# EasyEDA Pro project coba1.eprj

# Schematic Schematic1
Board Name: Board1; Create Date: 2026-02-27; Page Name: P1; Project Name: coba1; Schematic Name: Schematic1; Update Date: 2026-02-28; Company: EasyEDA.com; Page Size: A4; Version: V1.0
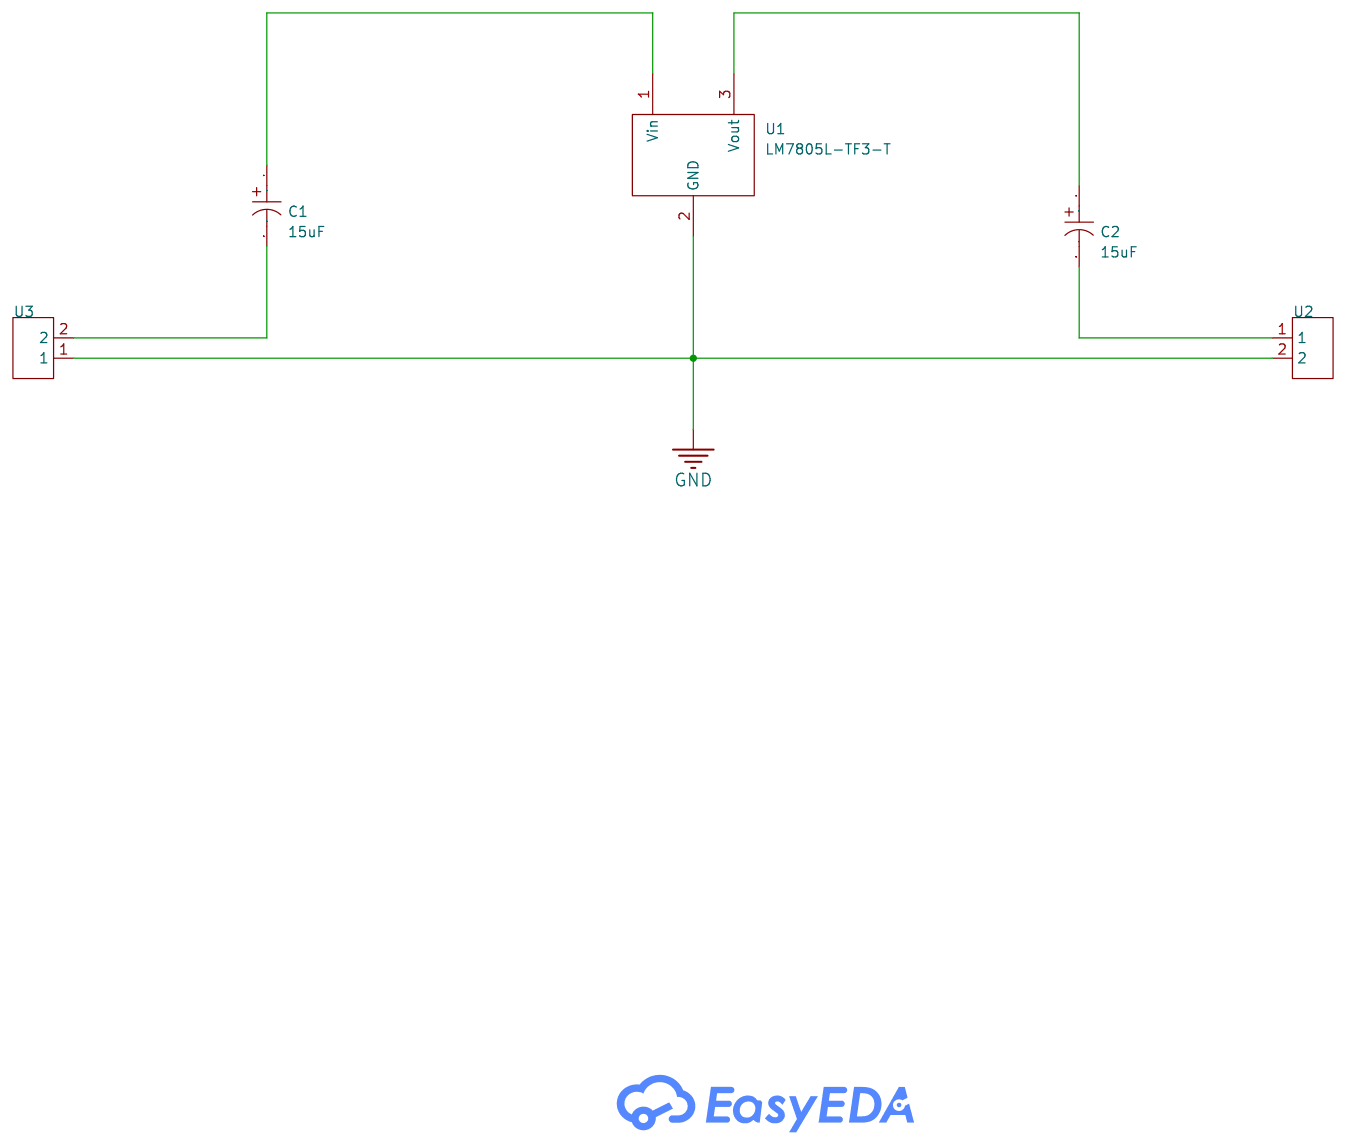
[diagram p0: schematic sheet]

## Parts
C1  15uF  [CAP-TH_BD8.3-P3.00-D0.6-FD]
C2  15uF  [CAP-TH_BD8.3-P3.00-D0.6-FD]
U1  LM7805L-TF3-T  [TO-220F-3_L10.2-W4.9-P2.54-L]
U2  TERM BLOCK HDR 2POS VERT 3.81M  [CONN-TH_2P-P3.81_DB2EVC-3.81-2P-WT]
U3  TERM BLOCK HDR 2POS VERT 3.81M  [CONN-TH_2P-P3.81_DB2EVC-3.81-2P-WT]

## Library data of the parts
C1 C2 = 15uF 450V: Supplier Part: C9900023023; Supplier Footprint: Capacitor;Electronic;15uF;450V; JLCPCB Part Class: Extended Part; Supplier: LCSC
U1 = LM7805L-TF3-T: LCSC Part Name: 输入35V 输出5V 1A; Supplier Part: C71107; Manufacturer: UTC(友顺); Supplier Footprint: TO-220F; JLCPCB Part Class: Extended Part; Datasheet: https://item.szlcsc.com/datasheet/LM7805L-TF3-T/72206.html; Supplier: LCSC; Output Type: Fixed; Voltage - Supply: 35V; Output Voltage: 5V; Output Current: 1A; Power Supply Rejection Ratio (PSRR): 80dB@(120Hz); Voltage Dropout: 2V; standby current: 8mA; Noise: 40uV; Features: Over Temperature Protection；Over Current Protection; Operating Temperature: -20℃~+125℃@(Tj); Output Configuration: Positive; Number of Outputs: 1
U2 U3 = TERM BLOCK HDR 2POS VERT 3.81M: Supplier Part: C9900190888; Supplier Footprint: 插件,P=3.81mm,2P; JLCPCB Part Class: Extended Part; Supplier: LCSC

## Nets
GND: U1.2(GND) U2.2 U3.1
$1N358: C1.1 U1.1(Vin)
$1N364: C2.1 U1.3(Vout)
$1N588: C2.2 U2.1
$1N594: C1.2 U3.2

# Board PCB1
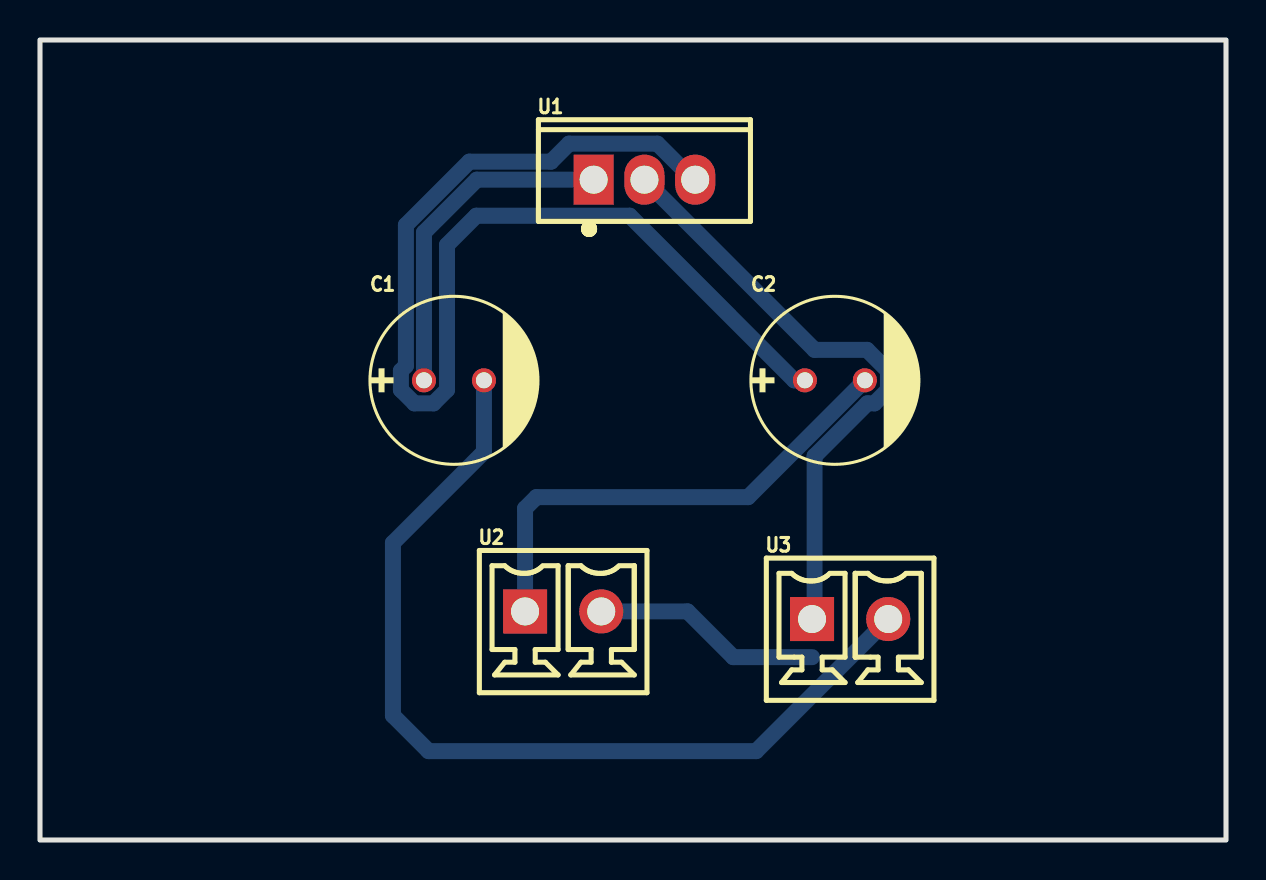
[diagram p1: board, top side]
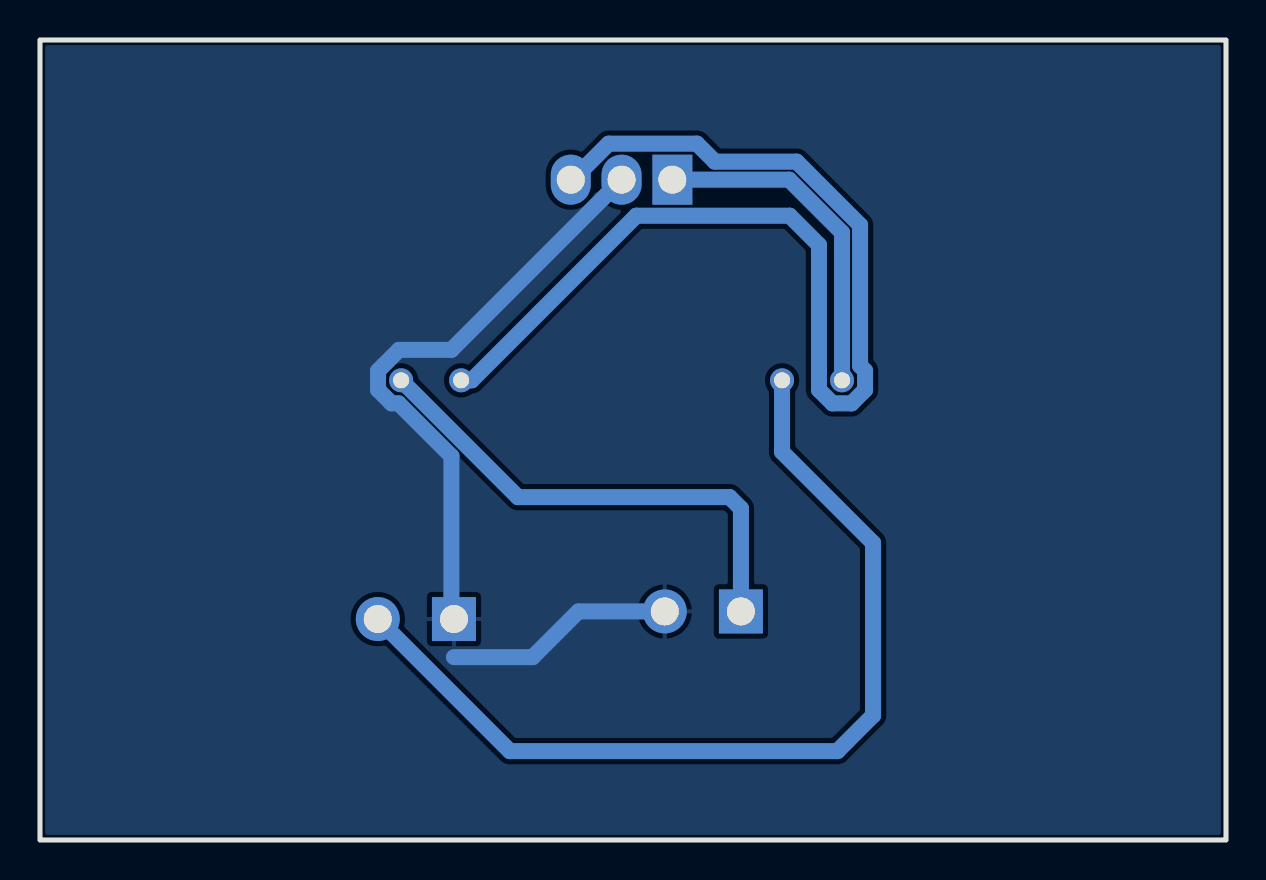
[diagram p2: board, bottom side, seen from below]

Outline 59.31 x 40.01 mm; copper layers: Top Layer, Bottom Layer. Coordinates in mm from the lower left corner of the outline.
Outline path: rectangle 0,40.01 59.31,0
Stack: Top Layer 0.035mm / Dielectric1 1.51mm FR4 er 4.5 / Bottom Layer 0.035mm

## Design rules (mm)
template: JLCPCB Capability(Two Layers Board)
spacing copperThickness1oz (default): track to track 0.102, other pairs 0.152 to 0.3
spacing copperThickness2oz: track to track 0.203, other pairs 0.152 to 0.3
track width copperThickness1oz (default): min 0.127, default 0.254, max 2.54
track width copperThickness2oz: min 0.203, default 0.254, max 2.54
differential pair differentialPair (default): width min 0.127, default 0.254, max 2.54; gap min 0.152, default 0.152
via viaSize (default): diameter min 0.5, default 0.61, max 10; hole min 0.3, default 0.305, max 6.3

## Placement (name value [footprint] x y rotation side)
C1  15uF  [CAP-TH_BD8.3-P3.00-D0.6-FD]  20.7 22.99 0 top
C2  15uF  [CAP-TH_BD8.3-P3.00-D0.6-FD]  39.75 22.99 0 top
U1  LM7805L-TF3-T  [TO-220F-3_L10.2-W4.9-P2.54-L]  30.23 33.02 0 top
U2  TERM BLOCK HDR 2POS VERT 3.81M  [CONN-TH_2P-P3.81_DB2EVC-3.81-2P-WT]  26.16 11.43 0 top
U3  TERM BLOCK HDR 2POS VERT 3.81M  [CONN-TH_2P-P3.81_DB2EVC-3.81-2P-WT]  40.51 11.05 0 top

## Footprints (pads in the part's own frame, mm; a bottom-side part is the same pattern mirrored in y, then rotated)
CAP-TH_BD8.3-P3.00-D0.6-FD
  round 1.202 hole 0.801: 1(-1.5,0) 2(1.5,0)
CONN-TH_2P-P3.81_DB2EVC-3.81-2P-WT
  rect 2.2x2.2 hole 1.4: 1(-1.905,0)
  round 2.2 hole 1.4: 2(1.905,0)
TO-220F-3_L10.2-W4.9-P2.54-L
  rect 2x2.5 hole 1.4: 1(-2.54,0)
  oval 2x2.5 hole 1.4: 2(0,0) 3(2.54,0)

## Nets
As in the schematic.

## Routing (per net, layer and track width the routed paths; a pad name or vN(x,y) marks a point on that pad's centre or on a via; arc(x,y) is an arc through that point)
GND: length 41.8
  Bottom Layer w0.8: U2.2 32.38,11.43 34.67,9.14 38.61,9.14 ; U3.1 38.73,11.18 38.73,19.2 41.37,21.83 41.73,21.83 42.4,22.51 42.4,23.46 41.36,24.51 38.73,24.51 U1.2
$1N358: length 17
  Bottom Layer w0.8: C1.1 19.2,30.38 21.84,33.02 U1.1
$1N364: length 57.3
  Bottom Layer w0.8: C2.1 37.72,22.99 29.49,31.22 21.82,31.22 20.35,29.75 20.35,22.51 19.68,21.83 18.72,21.83 18.05,22.51 18.05,23.46 18.3,23.72 18.3,30.75 21.47,33.92 25.56,33.92 26.46,34.82 30.87,34.82 32.67,33.02 U1.3
$1N588: length 24.8
  Bottom Layer w0.8: C2.2 35.41,17.15 24.82,17.15 24.26,16.58 U2.1
$1N594: length 46.9
  Bottom Layer w0.8: C1.2 22.2,19.41 17.65,14.86 17.65,6.23 19.43,4.45 35.81,4.45 U3.2

## Copper pours and planes (outline as drawn; the poured copper is in the pictures)
GND on Bottom Layer: -0.64,40.89 60.58,40.89 60.58,-1.02 -0.64,-1.02
